# Altium schematic sheet AC.SchDoc
size A4
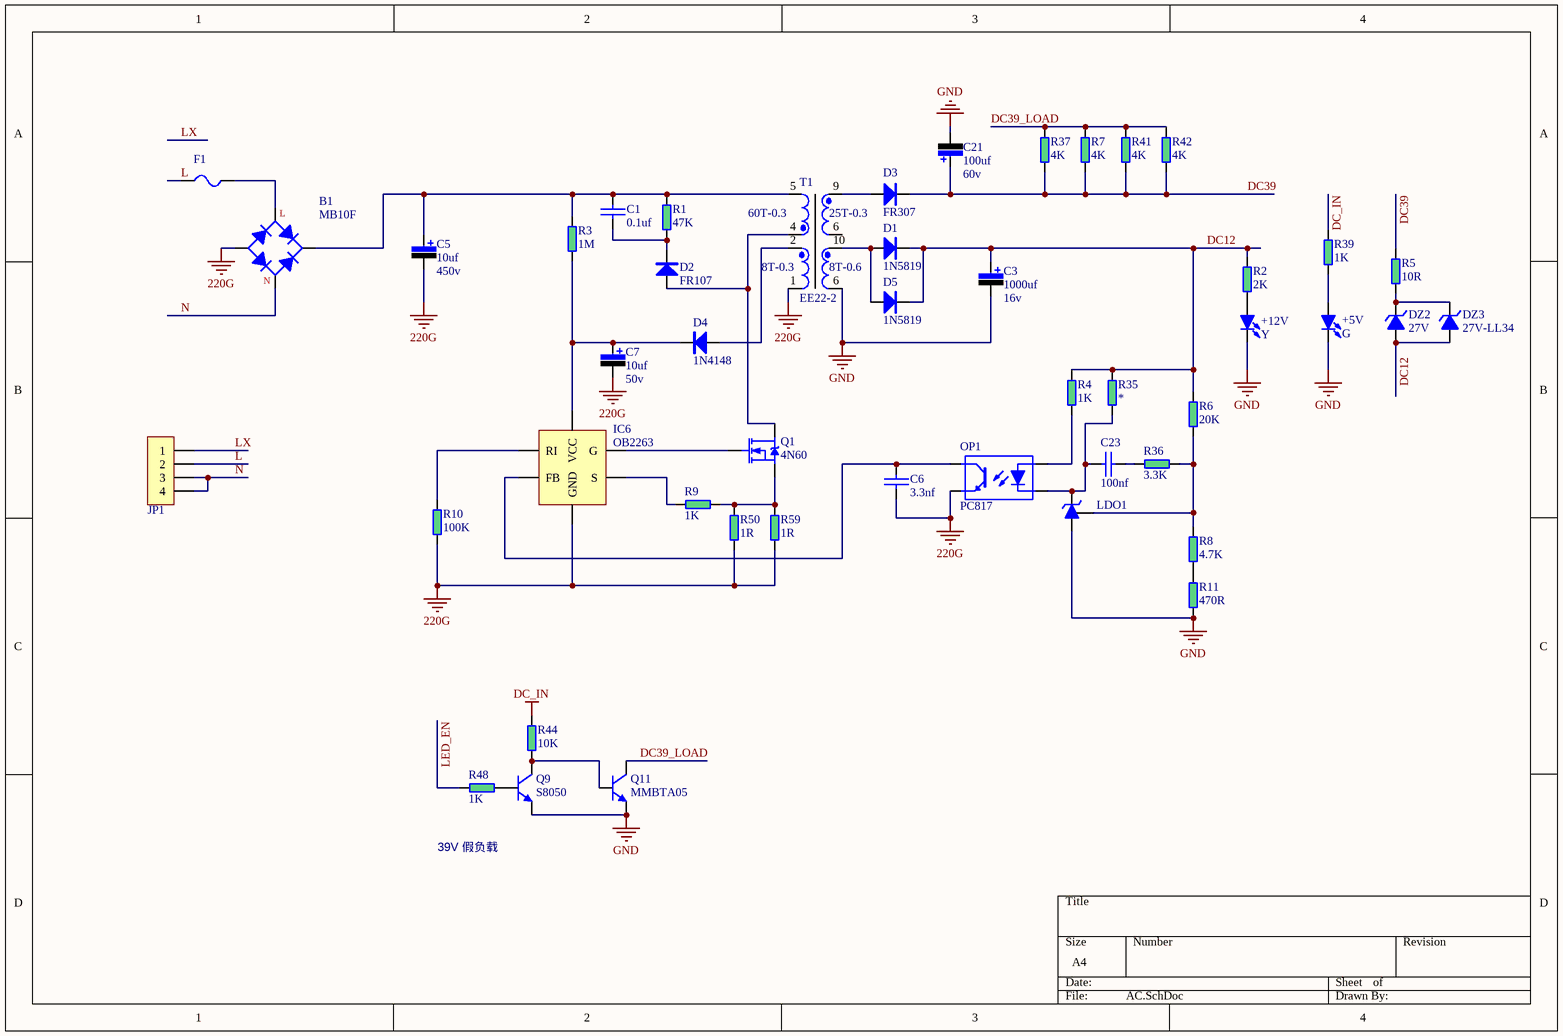
[diagram p0: AC.SchDoc]

## Parts
+5V  G  [LED 0603B]
+12V  Y  [LED 0603B]
B1  MB10F  [D MBF]
C1  value 0.1uf  [CY 5*7]  (hidden comment: 04.Cap)
C3  value 1000uf  value 16v  [CAP 16v1000uf（8*11）]  (hidden comment: 05.Cap-EC)
C5  value 10uf  value 450v  [CAP 450v10uf（10*16）]  (hidden comment: 05.Cap-EC)
C6  value 3.3nf  [C 0603]  (hidden comment: 04.Cap)
C7  value 10uf  value 50v  [CAP 50v10uf（5*8）]  (hidden comment: 05.Cap-EC)
C21  value 100uf  value 60v  [CAP 63V100uf（8*11）]  (hidden comment: 05.Cap-EC)
C23  value 100nf  [C 0603]  (hidden comment: 04.Cap)
D1  1N5819  [DO-41V]
D2  FR107  [DO-41]
D3  FR307  [DO-201ADV]
D4  1N4148  [D 1N4148-LL34]
D5  1N5819  [DO-41V]
DZ2  27V  [D 1N4750/1W/27V/LL41]
DZ3  27V-LL34  [D ZMM4V7-LL34]
F1  11.Fuse  [FU 3x10]  (value not drawn)
IC6  OB2263  [SOT23-6L]
JP1  Pin04  [KF7620-4P]  (value not drawn)
LDO1  TL431  [P TL431-SOT23]  (value not drawn)
OP1  PC817  [OP PC817-SMD]
Q1  4N60  [FET-AOD4N60/600V/4A-TO252]
Q9  S8050  [BJT-S8050/40V/1.5A-SOT23]
Q11  MMBTA05  [BJT-MMBTA05/60V/0.5A-SOT23]
R1  47K  [RS 1/2W-V4]
R2  2K  [R 0603]
R3  1M  [RS 1/4W-V3]
R4  1K  [R 0603]
R5  10R  [R 1206]
R6  20K  [R 0603]
R7  4K  [RS 1W-V5]
R8  4.7K  [R 0603]
R9  1K  [R 0603]
R10  100K  [R 0603]
R11  470R  [R 0603]
R35  *  [R 0603]
R36  3.3K  [R 0603]
R37  4K  [RS 1W-V5]
R39  1K  [R 0603]
R41  4K  [RS 1W-V5]
R42  4K  [RS 1W-V5]
R44  10K  [R 0603]
R48  1K  [R 0603]
R50  1R  [R 1206]
R59  1R  [R 1206]
T1  EE22-2  [EE22]

## Nets
220G: B1.DC- C5.2 C6.2 C7.2 IC6.1(GND) OP1.E R10.1 R50.1 R59.1 T1.1(Sec2-)
DC_IN: R39.2 R44.2
GND: +5V.K +12V.K C3.2 C21.2 LDO1.A Q9.E Q11.E R11.1 T1.6(Pri-)
DC12: C3.1 D1.K D5.K DZ2.A DZ3.A R2.2 R4.2 R6.2 R35.2
DC39: C21.1 D3.K R5.1 R7.2 R37.2 R41.2 R42.2
DC39_LOAD: Q11.C R7.1 R37.1 R41.1 R42.1
L: F1.1 JP1.2
LED_EN: R48.1
LX: JP1.1
N: B1.AC2 JP1.3 JP1.4
Net+5V_A: +5V.A R39.1
Net+12V_A: +12V.A R2.1
NetB1_AC1: B1.AC1 F1.2
NetB1_DC+: B1.DC+ C1.1 C5.1 R1.1 R3.1 T1.5(Sec1+)
NetC1_2: C1.2 D2.K R1.2
NetC6_1: C6.1 IC6.2(FB) OP1.C
NetC7_1: C7.1 D4.K IC6.5(VCC) R3.2
NetC23_1: C23.1 LDO1.K OP1.K R35.1
NetC23_2: C23.2 R36.1
NetD1_A: D1.A D5.A T1.10(Pri+)
NetD2_A: D2.A Q1.D T1.4(Sec1-)
NetD3_A: D3.A T1.9(Pri+)
NetD4_A: D4.A T1.2(Sec2+)
NetDZ2_K: DZ2.K DZ3.K R5.2
NetIC6_3: IC6.3(RI) R10.2
NetIC6_4: IC6.4(S) R9.1
NetIC6_6: IC6.6(G) Q1.G
NetLDO1_R: LDO1.R R6.1 R8.2 R36.2
NetOP1_A: OP1.A R4.1
NetQ1_S: Q1.S R9.2 R50.2 R59.2
NetQ9_B: Q9.B R48.2
NetQ9_C: Q9.C Q11.B R44.1
NetR8_1: R8.1 R11.2

## Notes on the sheet
- (near T1) 60T-0.3
- (near T1) 25T-0.3
- (near T1) 8T-0.3
- (near T1) 8T-0.6
- 39V 假负载
- (in symbol 14.Diode - Rectifier) L; N

## Library data of the parts
+5V +12V = 15.Diode - LED: LED
B1 = 14.Diode - Rectifier: 整流桥
C1 C6 C23 = 04.Cap: 电容
C3 C5 C7 C21 = 05.Cap-EC: 电解电容
D1-D5 = 12.Diode: 二极管
DZ2 DZ3 = 13.Diode - Zen: 稳压管
F1 = 11.Fuse: 保险丝
LDO1 = TL431: 电压基准（out=Ref*(1+R1/R2)）
OP1 = 17.Optocoupler: 光耦
Q1 = 09.FET(N): MOS管 NPN
Q9 Q11 = 07.BJT(N): 三极管 NPN
R1-R11 R35-R37 R39 R41 R42 R44 R48 R50 R59 = 01.Res: 电阻